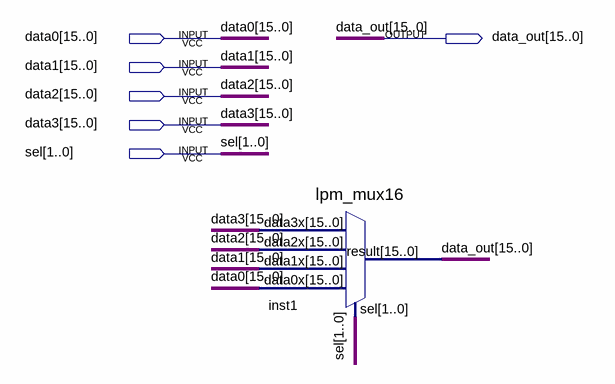
[diagram p0: schematic sheet]
// Quartus schematic data_mux_4to1.bdf as structural Verilog: 1 symbols, 6 pins
module data_mux_4to1 (
  input  [15:0] data0,
  input  [15:0] data1,
  input  [15:0] data2,
  input  [15:0] data3,
  input  [1:0] sel,
  output [15:0] data_out
);

  lpm_mux16 inst1 (.data3x(data3), .data2x(data2), .data1x(data1), .data0x(data0), .sel(sel), .result(data_out));
endmodule
